# EasyEDA schematic OpenTCU-TTGO.json
TITLE: Sheet_1; REV: 1.0; Date: 2024-07-19; Sheet: 1/1; Drawn By: tristan.read1508; Company: Your Company
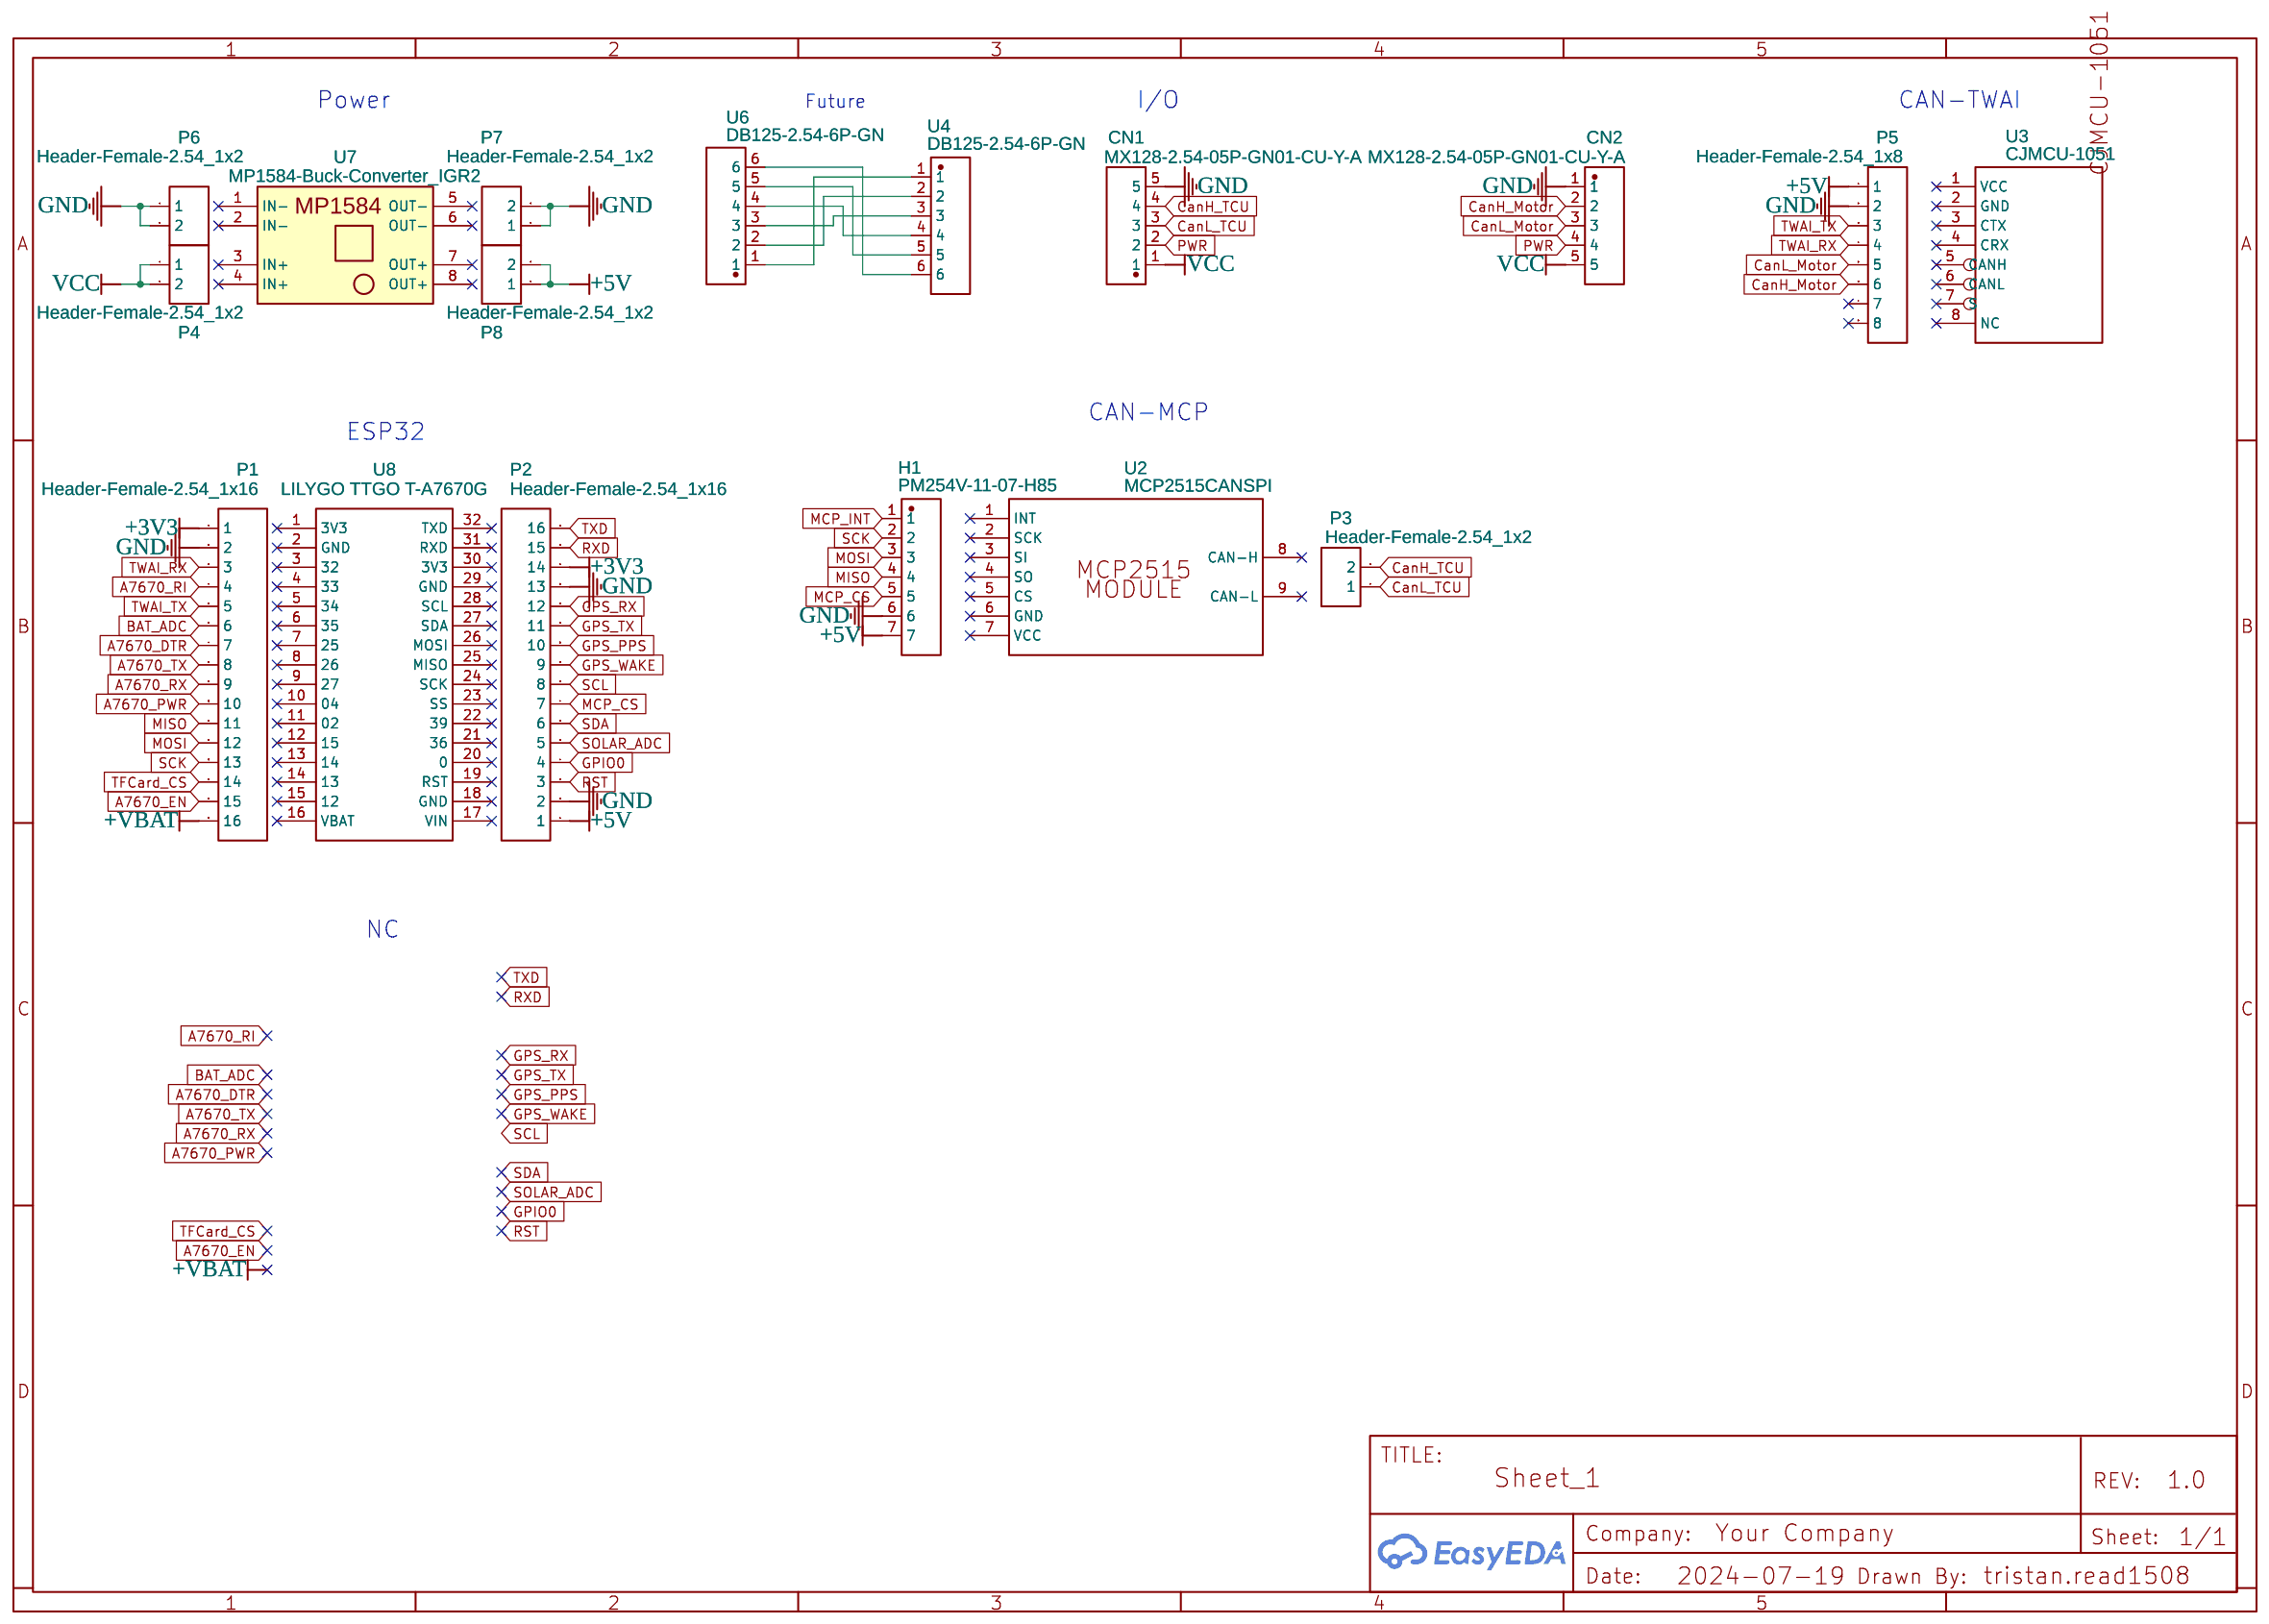
[diagram p0: schematic sheet]

## Parts
CN1  MX128-2.54-05P-GN01-CU-Y-A  [CONN-TH_5P-P2.54_MX128-2.54-05P-GN01-CU-Y-A]
CN2  MX128-2.54-05P-GN01-CU-Y-A  [CONN-TH_5P-P2.54_MX128-2.54-05P-GN01-CU-Y-A]
H1  PM254V-11-07-H85  [HDR-TH_7P-P2.54-V-F]
P1  Header-Female-2.54_1x16  [HDR-TH_16P-P2.54-V-F-1]
P2  Header-Female-2.54_1x16  [HDR-TH_16P-P2.54-V-F-1]
P3  Header-Female-2.54_1x2  [HDR-TH_2P-P2.54-V-F]
P4  Header-Female-2.54_1x2  [HDR-TH_2P-P2.54-V-F]
P5  Header-Female-2.54_1x8  [HDR-TH_8P-P2.54-V-F-1]
P6  Header-Female-2.54_1x2  [HDR-TH_2P-P2.54-V-F]
P7  Header-Female-2.54_1x2  [HDR-TH_2P-P2.54-V-F]
P8  Header-Female-2.54_1x2  [HDR-TH_2P-P2.54-V-F]
U2  MCP2515CANSPI  [MCP2515CANSPI]
U3  CJMCU-1051  [CJMCU-1051]
U4  DB125-2.54-6P-GN  [CONN-TH_DB125-2.54-6P-GN]
U6  DB125-2.54-6P-GN  [CONN-TH_DB125-2.54-6P-GN]
U7  MP1584-Buck-Converter_IGR2  [MP1584EN-BUCK-CONVERTER]
U8  LILYGO TTGO T-A7670G  [LILYGO TTGO T-SIM7000G]

## Library data of the parts
CN1 CN2 = MX128-2.54-05P-GN01-CU-Y-A: Supplier: LCSC; Supplier Part: C5188445; Manufacturer: MAX(迈旭); Manufacturer Part: MX128-2.54-05P-GN01-Cu-Y-A; Contributor: lcsc; JLCPCB Part Class: Extended Part
H1 = PM254V-11-07-H85: Contributor: LCSC; Supplier: LCSC; Supplier Part: C2832270; Manufacturer: XFCN(兴飞); JLCPCB Part Class: Extended Part
P1 P2 = Header-Female-2.54_1x16: Supplier: LCSC; Manufacturer: BOOMELE(博穆精密); Manufacturer Part: 2.54-1*16P母; Supplier Part: C66987; JLCPCB Part Class: Extended Part
P3 = Header-Female-2.54_1x2: Supplier: LCSC; Manufacturer: BOOMELE(博穆精密); Manufacturer Part: 2.54-1*2P母; Supplier Part: C49661; JLCPCB Part Class: Extended Part
P4 P6-P8 = Header-Female-2.54_1x2: Supplier: LCSC; Manufacturer: BOOMELE(博穆精密); Manufacturer Part: 2.54-1*2P母; Supplier Part: C49661; JLCPCB Part Class: Extended Part; link: https://lcsc.com/eda_search?q=C49661&%26type=1&ref=editor
P5 = Header-Female-2.54_1x8: Supplier: LCSC; Manufacturer: BOOMELE(博穆精密); Manufacturer Part: 2.54-1*8P母环保; Supplier Part: C27438; JLCPCB Part Class: Extended Part
U2 = MCP2515CANSPI: Contributor: rclandrover
U3 = CJMCU-1051: Contributor: ratedspg10
U4 U6 = DB125-2.54-6P-GN: Contributor: LCSC; Supplier: LCSC; Supplier Part: C918124; Manufacturer: DORABO(地博电气); Manufacturer Part: DB125-2.54-6P-GN-S; JLCPCB Part Class: Extended Part
U7 = MP1584-Buck-Converter_IGR2: Manufacturer Part: MP1584EN; Contributor: fazli wadood
U8 = LILYGO TTGO T-SIM7000G: Contributor: mounir222

## Nets
+3V3: P1.1 P2.14
+5V: H1.7 P2.1 P5.1 P8.1 P8.2
+VBAT: P1.16
GND: CN1.5 CN2.1 H1.6 P1.2 P2.2 P2.13 P5.2 P6.1 P6.2 P7.1 P7.2
VCC: CN1.1 CN2.5 P4.1 P4.2
A7670_DTR: P1.7
A7670_EN: P1.15
A7670_PWR: P1.10
A7670_RI: P1.4
A7670_RX: P1.9
A7670_TX: P1.8
BAT_ADC: P1.6
CanH_Motor: CN2.2 P5.6
CanH_TCU: CN1.4 P3.2
CanL_Motor: CN2.3 P5.5
CanL_TCU: CN1.3 P3.1
GPIO0: P2.4
GPS_PPS: P2.10
GPS_RX: P2.12
GPS_TX: P2.11
GPS_WAKE: P2.9
MCP_CS: H1.5 P2.7
MCP_INT: H1.1
MISO: H1.4 P1.11
MOSI: H1.3 P1.12
PWR: CN1.2 CN2.4
RST: P2.3
RXD: P2.15
SCK: H1.2 P1.13
SCL: P2.8
SDA: P2.6
SOLAR_ADC: P2.5
TFCard_CS: P1.14
TWAI_RX: P1.3 P5.4
TWAI_TX: P1.5 P5.3
TXD: P2.16
Net-(U4-1): U4.1 U6.1
Net-(U4-2): U4.2 U6.2
Net-(U4-3): U4.3 U6.3
Net-(U4-4): U4.4 U6.4
Net-(U4-5): U4.5 U6.5
Net-(U4-6): U4.6 U6.6

Not connected (* = marked no-connect by the designer): P5 7* 8*; U2 1(INT)* 2(SCK)* 3(SI)* 4(SO)* 5(CS)* 6(GND)* 7(VCC)* 8(CAN-H)* 9(CAN-L)*; U3 1(VCC)* 2(GND)* 3(CTX)* 4(CRX)* 5(CANH)* 6(CANL)* 7(S)* 8(NC)*; U7 1(IN-)* 2(IN-)* 3(IN+)* 4(IN+)* 5(OUT-)* 6(OUT-)* 7(OUT+)* 8(OUT+)*; U8 1(3V3)* 2(GND)* 3(32)* 4(33)* 5(34)* 6(35)* 7(25)* 8(26)* 9(27)* 10(04)* 11(02)* 12(15)* 13(14)* 14(13)* 15(12)* 16(VBAT)* 17(VIN)* 18(GND)* 19(RST)* 20(0)* 21(36)* 22(39)* 23(SS)* 24(SCK)* 25(MISO)* 26(MOSI)* 27(SDA)* 28(SCL)* 29(GND)* 30(3V3)* 31(RXD)* 32(TXD)*

## Notes on the sheet
- Power
- Future
- I/O
- CAN-TWAI
- CAN-MCP
- ESP32
- NC
